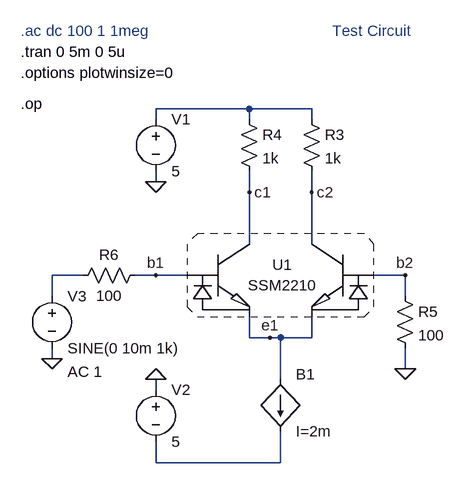
[diagram p0: schematic SSM2210_test1.asc]
SSM2210_test1.asc, the LTspice schematic file:
Version 4
SHEET 1 1156 680
WIRE 160 -64 16 -64
WIRE 256 -64 160 -64
WIRE 16 -48 16 -64
WIRE 160 -48 160 -64
WIRE 256 -48 256 -64
WIRE 16 48 16 32
WIRE 160 64 160 32
WIRE 256 64 256 32
WIRE 160 144 160 64
WIRE 256 144 256 64
WIRE -96 192 -144 192
WIRE 16 192 -16 192
WIRE 64 192 16 192
WIRE 400 192 352 192
WIRE -144 224 -144 192
WIRE 400 224 400 192
WIRE 160 288 160 256
WIRE 192 288 160 288
WIRE 208 288 192 288
WIRE 256 288 256 256
WIRE 256 288 208 288
WIRE -144 320 -144 304
WIRE 400 336 400 304
WIRE 208 352 208 288
WIRE 16 368 16 352
WIRE 16 480 16 448
WIRE 208 480 208 432
WIRE 208 480 16 480
FLAG -144 320 0
FLAG 16 48 0
FLAG 400 336 0
FLAG 16 352 0
FLAG 160 64 c1
FLAG 256 64 c2
FLAG 192 288 e1
FLAG 16 192 b1
FLAG 400 192 b2
SYMBOL voltage 16 -64 R0
SYMATTR InstName V1
SYMATTR Value 5
SYMBOL voltage 16 352 R0
SYMATTR InstName V2
SYMATTR Value 5
SYMBOL voltage -144 208 R0
WINDOW 123 24 132 Left 0
WINDOW 39 0 0 Left 0
SYMATTR Value2 AC 1
SYMATTR InstName V3
SYMATTR Value SINE(0 10m 1k)
SYMBOL res 240 -64 R0
SYMATTR InstName R3
SYMATTR Value 1k
SYMBOL res 144 -64 R0
SYMATTR InstName R4
SYMATTR Value 1k
SYMBOL res 384 208 R0
SYMATTR InstName R5
SYMATTR Value 100
SYMBOL res -112 208 R270
WINDOW 0 32 56 VTop 0
WINDOW 3 0 56 VBottom 0
SYMATTR InstName R6
SYMATTR Value 100
SYMBOL bi2 208 432 M180
WINDOW 0 24 88 Left 0
WINDOW 3 24 0 Left 0
SYMATTR InstName B1
SYMATTR Value I=2m
SYMBOL SSM2210 96 144 R0
SYMATTR InstName U1
TEXT -192 -72 Left 0 !.op
TEXT -192 -152 Left 0 !.tran 0 5m 0 5u
TEXT -192 -120 Left 0 !.options plotwinsize=0
TEXT -192 -184 Left 0 ;.ac dc 100 1 1meg
TEXT 288 -184 Left 0 ;Test Circuit

The netlist it stands for:
* SSM2210_test1.asc
V1 N001 0 5
V2 0 N003 5
V3 N002 0 SINE(0 10m 1k) AC 1
R3 N001 c2 1k
R4 N001 c1 1k
R5 b2 0 100
R6 N002 b1 100
B1 e1 N003 I=2m
XU1 c1 b1 e1 e1 b2 c2 SSM2210  ; pins C1 B1 E1 E2 B2 C2
.op
.tran 0 5m 0 5u
.options plotwinsize=0
* .ac dc 100 1 1meg
* Test Circuit
.lib SSM2210.sub
.backanno
.end